# Altium schematic sheet ch438-MCU.SchDoc
size A4
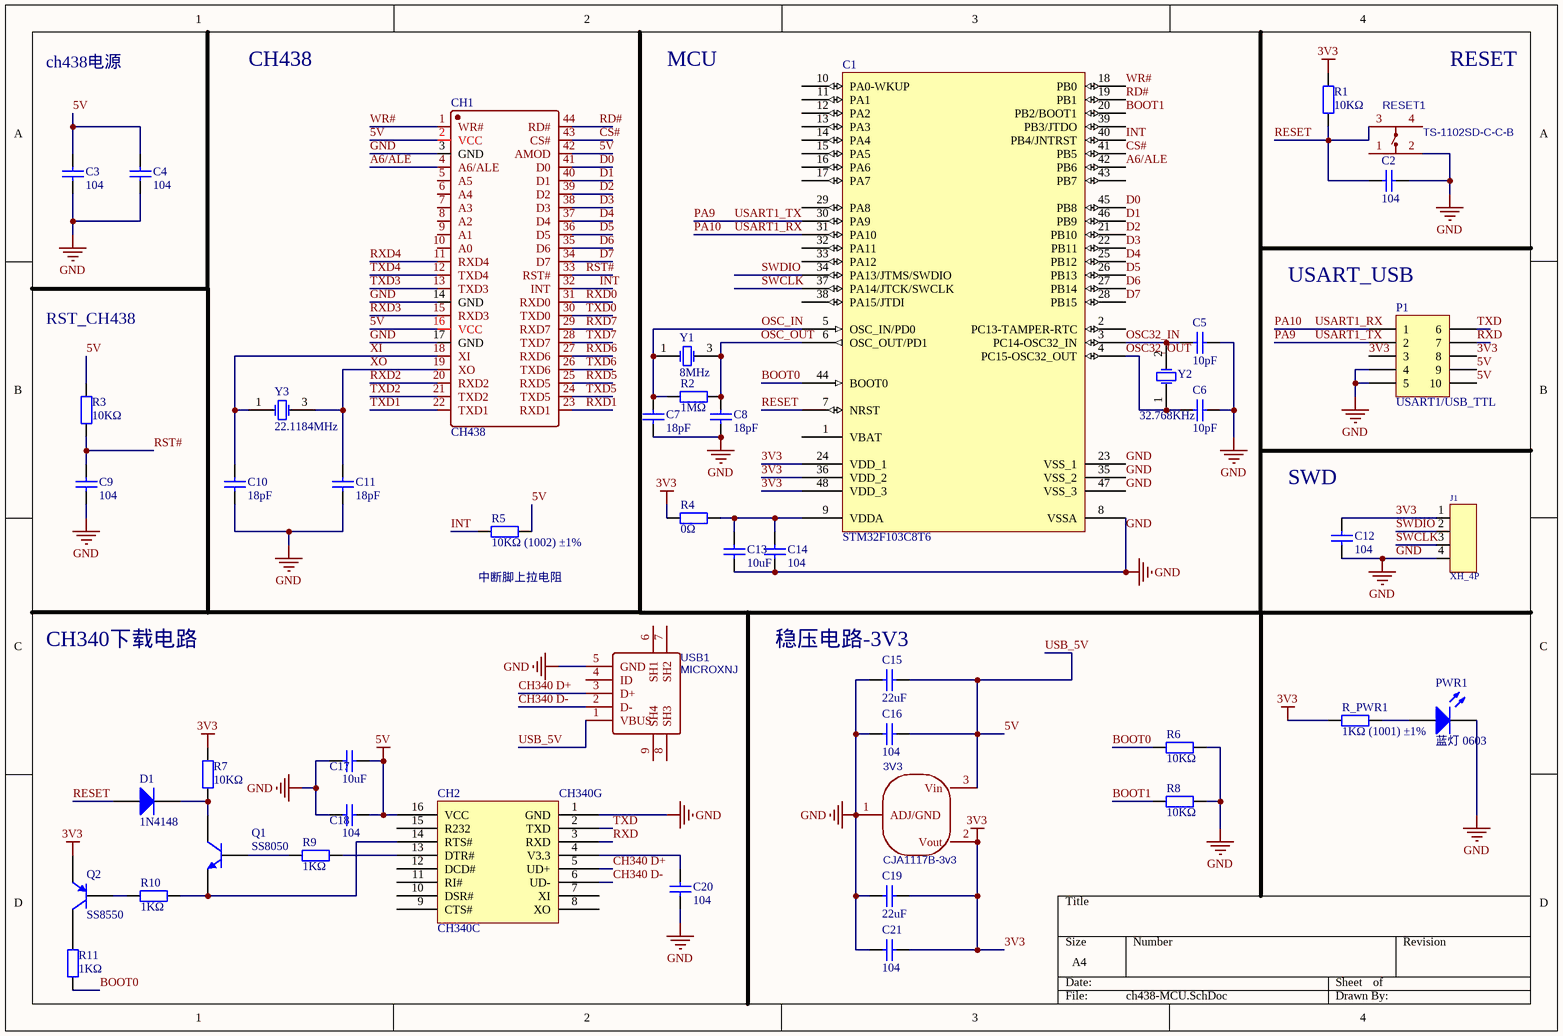
[diagram p0: ch438-MCU.SchDoc]

## Parts
3V3  CJA1117B-3v3  [SOT-89_L4.5-W2.5-P1.50-LS4.2-BR]
C1  STM32F103C8T6  [LQFP48_N]
C2  104  [0603_C]
C3  104  [0603_C]
C4  104  [0603_C]
C5  10pF  [0603_C]
C6  10pF  [0603_C]
C7  18pF  [0603_C]
C8  18pF  [0603_C]
C9  104  [0603_C]
C10  18pF  [0603_C]
C11  18pF  [0603_C]
C12  104  [0603_C]
C13  10uF  [0603_C]
C14  104  [0603_C]
C15  22uF  [0603_C]
C16  104  [0603_C]
C17  10uF  [0603_C]
C18  104  [0603_C]
C19  22uF  [0603_C]
C20  104  [0603_C]
C21  104  [0603_C]
CH1  CH438  [LQFP-44_L10.0-W10.0-P0.80-LS12.0-BL]
CH2  CH340C  [SOIC-16_150mil]
D1  1N4148  [DO-35]
J1  XH_4P  [XH_4P直插弯针]
P1  USART1/USB_TTL  [HDR2X5_CEN]
PWR1  蓝灯 0603  [0603_LED_S1]
Q1  SS8050  [SOT-23(SOT-23-3)]
Q2  SS8550  [SOT-23(SOT-23-3)]
R1  10KΩ  [0603_R]
R2  1MΩ  [0603_R]
R3  10KΩ  [0603_R]
R4  0Ω  [0603_R]
R5  10KΩ (1002) ±1%  [0603_R]
R6  10KΩ  [0603_R]
R7  10KΩ  [0603_R]
R8  10KΩ  [0603_R]
R9  1KΩ  [0603_R]
R10  1KΩ  [0603_R]
R11  1KΩ  [0603_R]
R_PWR1  1KΩ (1001) ±1%  [0603_R]
RESET1  TS-1102SD-C-C-B  [SW-SMD_4P-L6.0-W6.0-P4.50-LS9.2]
USB1  MICROXNJ  [MICRO-USB-SMD_MICROXNJ]
Y1  8MHz  [SMD-3225_4P]
Y2  32.768KHz  [SMD-3215_2P FC - 135]
Y3  22.1184MHz  [SMD-3225_4P]

## Nets
3V3: 3V3.2(Vout) C1.24(VDD_1) C1.36(VDD_2) C1.48(VDD_3) C12.2 C19.2 C21.2 J1.1 P1.3 P1.8 Q2.2(E) R1.2 R4.2 R7.2 R_PWR1.1
5V: 3V3.3(Vin) C3.2 C4.2 C15.2 C16.2 C17.2 C18.1 CH1.2(VCC) CH1.16(VCC) CH1.42(AMOD) CH2.16(VCC) P1.9 P1.10 R3.2 R5.2 USB1.1(VBUS)  [also labelled USB_5V]
GND: 3V3.1(ADJ/GND) C1.8(VSSA) C1.23(VSS_1) C1.35(VSS_2) C1.47(VSS_3) C2.2 C3.1 C4.1 C5.2 C6.2 C7.1 C8.1 C9.1 C10.1 C11.1 C12.1 C13.1 C14.2 C15.1 C16.1 C17.1 C18.2 C19.1 C20.1 C21.1 CH1.3(GND) CH1.14(GND) CH1.17(GND) CH2.1(GND) J1.4 P1.4 P1.5 PWR1.K R6.2 R8.2 RESET1.2 USB1.5(GND)
A6/ALE: C1.42(PB6) CH1.4(A6/ALE)
BOOT0: C1.44(BOOT0) R6.1 R11.1
BOOT1: C1.20(PB2/BOOT1) R8.1
CH340 D+: CH2.5(UD+) USB1.3(D+)
CH340 D-: CH2.6(UD-) USB1.2(D-)
CS#: C1.41(PB5) CH1.43(CS#)
D0: C1.45(PB8) CH1.41(D0)
D1: C1.46(PB9) CH1.40(D1)
D2: C1.21(PB10) CH1.39(D2)
D3: C1.22(PB11) CH1.38(D3)
D4: C1.25(PB12) CH1.37(D4)
D5: C1.26(PB13) CH1.36(D5)
D6: C1.27(PB14) CH1.35(D6)
D7: C1.28(PB15) CH1.34(D7)
INT: C1.40(PB4/JNTRST) CH1.32(INT) R5.1
OSC32_IN: C1.3(PC14-OSC32_IN) C5.1 Y2.2(OSC2)
OSC32_OUT: C1.4(PC15-OSC32_OUT) C6.1 Y2.1(OSC1)
OSC_IN: C1.5(OSC_IN/PD0) C7.2 R2.1 Y1.1(OSC1)
OSC_OUT: C1.6(OSC_OUT/PD1) C8.2 R2.2 Y1.3(OSC2)
PA9: C1.30(PA9) P1.2  [also labelled USART1_TX]
PA10: C1.31(PA10) P1.1  [also labelled USART1_RX]
RD#: C1.19(PB1) CH1.44(RD#)
RESET: C1.7(NRST) C2.1 D1.1(A) R1.1 RESET1.3
RST#: C9.2 CH1.33(RST#) R3.1
RXD: CH2.3(RXD) P1.7
RXD0: CH1.31(RXD0)
RXD1: CH1.23(RXD1)
RXD2: CH1.20(RXD2)
RXD3: CH1.15(RXD3)
RXD4: CH1.11(RXD4)
RXD5: CH1.25(RXD5)
RXD6: CH1.27(RXD6)
RXD7: CH1.29(RXD7)
SWCLK: C1.37(PA14/JTCK/SWCLK) J1.3
SWDIO: C1.34(PA13/JTMS/SWDIO) J1.2
TXD: CH2.2(TXD) P1.6
TXD0: CH1.30(TXD0)
TXD1: CH1.22(TXD1)
TXD2: CH1.21(TXD2)
TXD3: CH1.13(TXD3)
TXD4: CH1.12(TXD4)
TXD5: CH1.24(TXD5)
TXD6: CH1.26(TXD6)
TXD7: CH1.28(TXD7)
WR#: C1.18(PB0) CH1.1(WR#)
XI: C10.2 CH1.18(XI) Y3.1(OSC1)
XO: C11.2 CH1.19(XO) Y3.3(OSC2)
NetC1_9: C1.9(VDDA) C13.2 C14.1 R4.1
NetC20_2: C20.2 CH2.4(V3.3)
NetCH2_13: CH2.13(DTR#) R9.2
NetCH2_14: CH2.14(RTS#) Q1.2(E) R10.2
NetD1_2: D1.2(K) Q1.3(C) R7.1
NetPWR1_A: PWR1.A R_PWR1.2
NetQ1_1: Q1.1(B) R9.1
NetQ2_1: Q2.1(B) R10.1
NetQ2_3: Q2.3(C) R11.2

Not connected (* = marked no-connect by the designer): C1 1(VBAT) 2(PC13-TAMPER-RTC) 10(PA0-WKUP) 11(PA1) 12(PA2) 13(PA3) 14(PA4) 15(PA5) 16(PA6) 17(PA7) 29(PA8) 32(PA11) 33(PA12) 38(PA15/JTDI) 39(PB3/JTDO) 43(PB7); CH1 5(A5) 6(A4) 7(A3) 8(A2) 9(A1) 10(A0); CH2 7(XI) 8(XO) 9(CTS#) 10(DSR#) 11(RI#) 12(DCD#) 15(R232); RESET1 1 4; USB1 4(ID) 6(SH1) 7(SH2) 8(SH3) 9(SH4)

## Notes on the sheet
- ch438电源
- CH438
- MCU
- RESET
- (near P1) USART_USB
- RST_CH438
- (near C12) SWD
- (near R5) 中断脚上拉电阻
- CH340下载电路
- (near C15) 稳压电路-3V3
- (in symbol CH340G_[C14267]) CH340G

## Library data of the parts
3V3 = CJA1117B-ADJ: BOM_Manufacturer: CJ; BOM_Supplier: LCSC; BOM_Manufacturer Part: CJA1117B-ADJ; BOM_Supplier Part: C107222; BOM_JLCPCB Part Class: Extended Part; spicePre: U; spiceSymbolName: CJA1117B-ADJ
C1 = STM32F103C8T6: STM32 ARM-based 32-bit MCU with 64 Kbytes Flash, 48-pin LQFP, Industrial Temperature; Published: 30-May-2008; DatasheetVersion: rev6, Mar-2008; PackageVersion: Mar-2008; PackageReference: LQFP48; Publisher: Altium Limited; PackageDescription: 48-Pin Low-Profile Quad Flat Pack, 7 x 7 mm Body, 0.5 mm Pitch (LQFP48); ComponentLink1Description: Manufacturer Link; ComponentLink1URL: www.st.com/stm32; ComponentLink2Description: Datasheet; ComponentLink2URL: http://www.st.com/stonline/products/literature/ds/13587.pdf
C2 C9-C12 C14 C16 C18 C20 C21 = 0603 100nF (104) 10% 50V: 贴片电容; ComponentLink1Description: 供应商链接; ComponentLink1URL: http://www.szlcsc.com/product/details_15331.html; Package: 0603; Supplier: LC; SuppliersPartNumber: C14663
C3 C4 = 0603 100pF (101) 5% 50V: 贴片电容; ComponentLink1Description: 供应商链接; ComponentLink1URL: http://www.szlcsc.com/product/details_15530.html; Package: 0603; Supplier: LC; SuppliersPartNumber: C14858
C5 C6 = 0603 10pF (100) 5% 50V: 贴片电容; ComponentLink1Description: 供应商链接; ComponentLink1URL: http://www.szlcsc.com/product/details_1986.html; Package: 0603; Supplier: LC; SuppliersPartNumber: C1634
C7 C8 = 0603 22pF (220) 5% 50V: 贴片电容; ComponentLink1Description: 供应商链接; ComponentLink1URL: http://www.szlcsc.com/product/details_2005.html; Package: 0603; Supplier: LC; SuppliersPartNumber: C1653
C13 C17 = 0603 10uF (106) 10% 10V: 贴片电容; ComponentLink1Description: 供应商链接; ComponentLink1URL: http://www.szlcsc.com/product/details_20411.html; Package: 0603; Supplier: LC; SuppliersPartNumber: C19702
C15 C19 = 0603 22uF (226) 20% 6.3V: 贴片电容; ComponentLink1Description: 供应商链接; ComponentLink1URL: http://www.szlcsc.com/product/details_60514.html; Package: 0603; Supplier: LC; SuppliersPartNumber: C59461
CH2 = CH340G_[C14267]: USB; ComponentLink1Description: 供应商链接; ComponentLink1URL: http://www.szlcsc.com/product/details_14927.html; Package: SOIC-16_150mil; Supplier: LC; SuppliersPartNumber: C14267
D1 = Diode 1N4148: High Conductance Fast Diode; Published: 8-Jun-2000; LatestRevisionDate: 17-Jul-2002; LatestRevisionNote: Re-released for DXP Platform.; DatasheetVersion: 1997; PackageReference: DO-35; Publisher: Altium Limited; PackageDescription: Diode, Axial; Body 3.8 x 1.9 mm (LxDia. max), Lead Dia. 0.53 mm (max); Code_JEDEC: DO-204-AH; ComponentLink1Description: Manufacturer Link; ComponentLink1URL: http://www.fairchildsemi.com/; ComponentLink2Description: Datasheet; ComponentLink2URL: http://www.fairchildsemi.com/ds/1N%2F1N4148.pdf
P1 = Header 5X2A: Header, 5-Pin, Dual row; LatestRevisionDate: 17-Jul-2002; LatestRevisionNote: Re-released for DXP Platform.; Publisher: Altium Limited
PWR1 = 0603 蓝灯: 发光二极管; ComponentLink1Description: 供应商链接; ComponentLink1URL: http://www.szlcsc.com/product/details_73150.html; Package: 0603; Supplier: LC; SuppliersPartNumber: C72041
Q1 = SOT-23 SS8050 Y1: 三极管; ComponentLink1Description: 供应商链接; ComponentLink1URL: http://www.szlcsc.com/product/details_2507.html; Package: SOT-23; Supplier: LC; SuppliersPartNumber: C2150
Q2 = SOT-23 SS8550 Y2: 三极管; ComponentLink1Description: 供应商链接; ComponentLink1URL: http://www.szlcsc.com/product/details_9037.html; Package: SOT-23; Supplier: LC; SuppliersPartNumber: C8542
R1 R3-R8 = 0603 10KΩ (1002) 1%: 贴片电阻; ComponentLink1Description: 供应商链接; ComponentLink1URL: http://www.szlcsc.com/product/details_26547.html; Package: 0603; Supplier: LC; SuppliersPartNumber: C25804
R2 = 0603 1MΩ (1004) 1%: 贴片电阻; ComponentLink1Description: 供应商链接; ComponentLink1URL: http://www.szlcsc.com/product/details_23662.html; Package: 0603; Supplier: LC; SuppliersPartNumber: C22935
R9-R11 R_PWR1 = 0603 1KΩ (1001) 1%: 贴片电阻; ComponentLink1Description: 供应商链接; ComponentLink1URL: http://www.szlcsc.com/product/details_21904.html; Package: 0603; Supplier: LC; SuppliersPartNumber: C21190
RESET1 = TS-1102SD-C-C-B: BOM_Manufacturer: XKB Connectivity(中国星坤); Contributor: LCSC; BOM_Supplier: LCSC; BOM_Supplier Part: C2935209; BOM_Manufacturer Part: TS-1102SD-C-C-B; spicePre: S; spiceSymbolName: TS-1102SD-C-C-B
USB1 = MICROXNJ: BOM_Manufacturer: SHOU HAN; Contributor: LCSC; BOM_Supplier: LCSC; BOM_Supplier Part: C404969; BOM_Manufacturer Part: MicroXNJ; BOM_JLCPCB Part Class: Extended Part; spicePre: U; spiceSymbolName: MICROXNJ
Y1 Y3 = SMD-3225_4P  12MHZ 20PF 10PPM: 贴片晶振; ComponentLink1Description: 供应商链接; ComponentLink1URL: http://www.szlcsc.com/product/details_9522.html; Package: SMD-3225_4P; Supplier: LC; SuppliersPartNumber: C9002
Y2 = SMD-3215_2P 32.768KHz 20ppm 12.5pF: 贴片晶振; ComponentLink1Description: 供应商链接; ComponentLink1URL: http://www.szlcsc.com/product/details_33310.html; Package: SMD-3215_2P; Supplier: LC; SuppliersPartNumber: C32346